# Altium schematic sheet FPGA_IOs.SchDoc: FPGA I/Os
size A4; Author: L. Sartory; Organization: L. Sartory; Address2: Nixie clock; Address3: with GPS synchronization; DocumentNumber: 6; Revision: B1; SheetNumber: 6; SheetTotal: 12
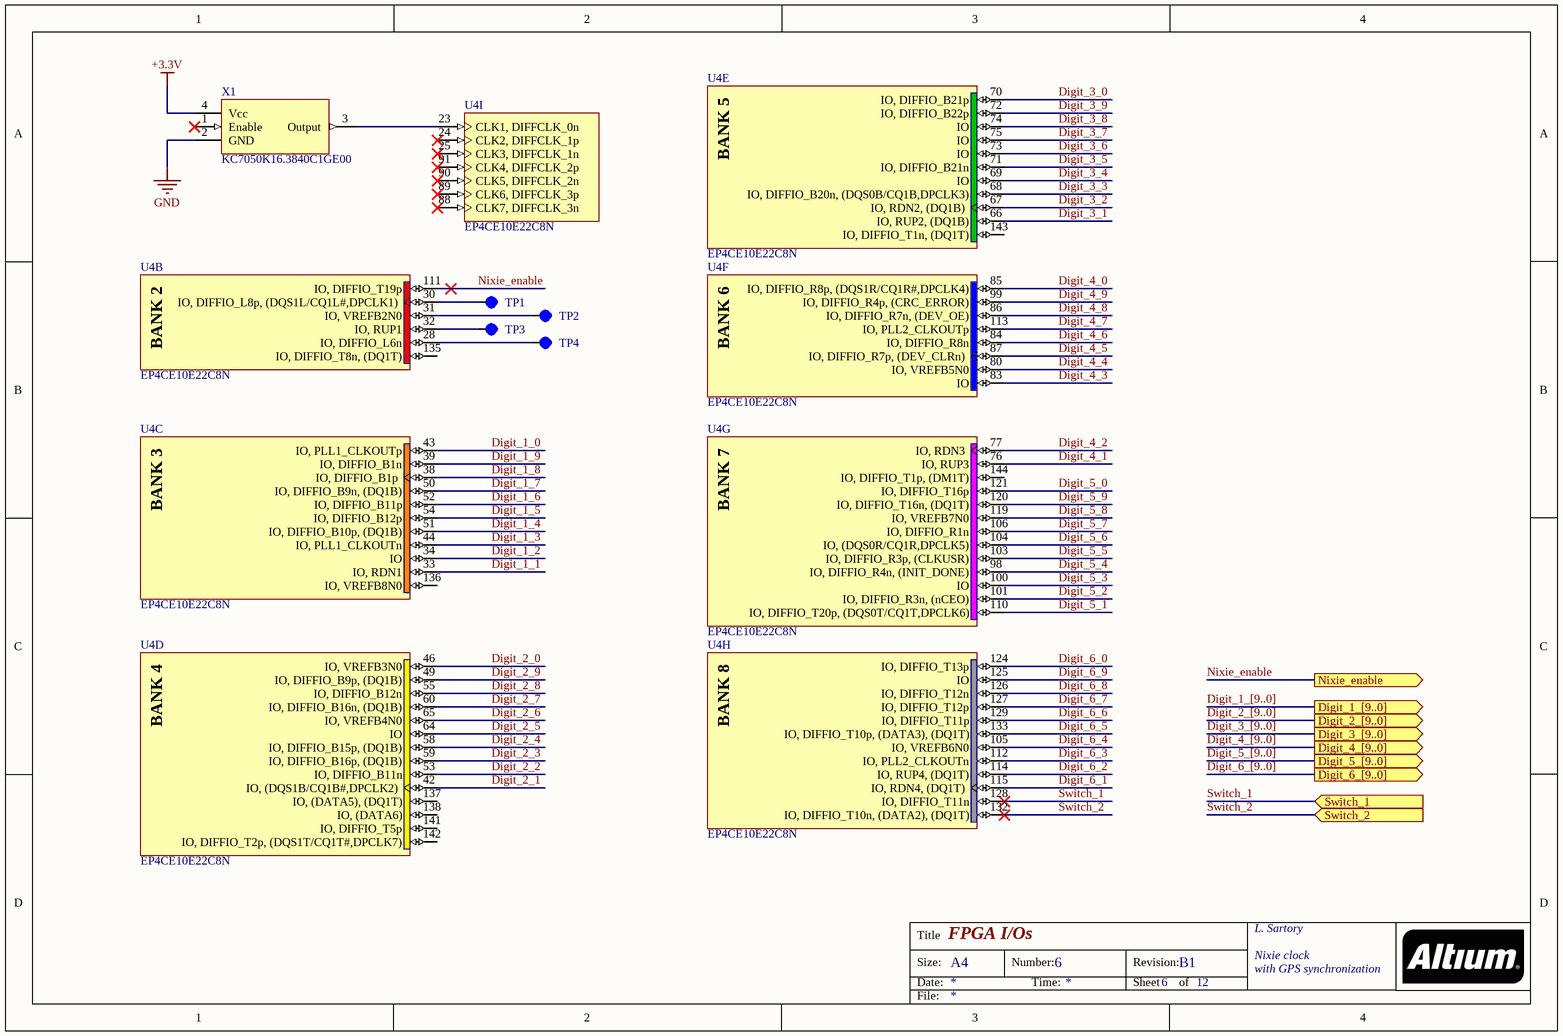
[diagram p0: FPGA_IOs.SchDoc]

## Parts
TP1  Test_point_1mm  [TEST_POINT_1MM]  (value not drawn)  (no BOM)
TP2  Test_point_1mm  [TEST_POINT_1MM]  (value not drawn)  (no BOM)
TP3  Test_point_1mm  [TEST_POINT_1MM]  (value not drawn)  (no BOM)
TP4  Test_point_1mm  [TEST_POINT_1MM]  (value not drawn)  (no BOM)
U4  EP4CE10E22C8N  [EP4CE10E22C8N]  (parts B,C,D,E,F,G,H,I of 13)
X1  KC7050K16.3840C1GE00  [KC7050K16.3840C1GE00]

## Ports
Digit_1_[9..0] (out), Digit_2_[9..0] (out), Digit_3_[9..0] (out), Digit_4_[9..0] (out), Digit_5_[9..0] (out), Digit_6_[9..0] (out), Nixie_enable (out), Switch_1 (in), Switch_2 (in)

## Nets
+3.3V: X1.4(Vcc)
GND: X1.2(GND)
Digit_1_0: U4.43(IO,_PLL1_CLKOUTp)
Digit_1_1: U4.33(IO,_RDN1)
Digit_1_2: U4.34(IO)
Digit_1_3: U4.44(IO,_PLL1_CLKOUTn)
Digit_1_4: U4.51(IO,_DIFFIO_B10p,_(DQ1B))
Digit_1_5: U4.54(IO,_DIFFIO_B12p)
Digit_1_6: U4.52(IO,_DIFFIO_B11p)
Digit_1_7: U4.50(IO,_DIFFIO_B9n,_(DQ1B))
Digit_1_8: U4.38(IO,_DIFFIO_B1p)
Digit_1_9: U4.39(IO,_DIFFIO_B1n)
Digit_2_0: U4.46(IO,_VREFB3N0)
Digit_2_1: U4.42(IO,_(DQS1B/CQ1B#,DPCLK2))
Digit_2_2: U4.53(IO,_DIFFIO_B11n)
Digit_2_3: U4.59(IO,_DIFFIO_B16p,_(DQ1B))
Digit_2_4: U4.58(IO,_DIFFIO_B15p,_(DQ1B))
Digit_2_5: U4.64(IO)
Digit_2_6: U4.65(IO,_VREFB4N0)
Digit_2_7: U4.60(IO,_DIFFIO_B16n,_(DQ1B))
Digit_2_8: U4.55(IO,_DIFFIO_B12n)
Digit_2_9: U4.49(IO,_DIFFIO_B9p,_(DQ1B))
Digit_3_0: U4.70(IO,_DIFFIO_B21p)
Digit_3_1: U4.66(IO,_RUP2,_(DQ1B))
Digit_3_2: U4.67(IO,_RDN2,_(DQ1B))
Digit_3_3: U4.68(IO,_DIFFIO_B20n,_(DQS0B/CQ1B,DPCLK3))
Digit_3_4: U4.69(IO)
Digit_3_5: U4.71(IO,_DIFFIO_B21n)
Digit_3_6: U4.73(IO)
Digit_3_7: U4.75(IO)
Digit_3_8: U4.74(IO)
Digit_3_9: U4.72(IO,_DIFFIO_B22p)
Digit_4_0: U4.85(IO,_DIFFIO_R8p,_(DQS1R/CQ1R#,DPCLK4))
Digit_4_1: U4.76(IO,_RUP3)
Digit_4_2: U4.77(IO,_RDN3)
Digit_4_3: U4.83(IO)
Digit_4_4: U4.80(IO,_VREFB5N0)
Digit_4_5: U4.87(IO,_DIFFIO_R7p,_(DEV_CLRn))
Digit_4_6: U4.84(IO,_DIFFIO_R8n)
Digit_4_7: U4.113(IO,_PLL2_CLKOUTp)
Digit_4_8: U4.86(IO,_DIFFIO_R7n,_(DEV_OE))
Digit_4_9: U4.99(IO,_DIFFIO_R4p,_(CRC_ERROR))
Digit_5_0: U4.121(IO,_DIFFIO_T16p)
Digit_5_1: U4.110(IO,_DIFFIO_T20p,_(DQS0T/CQ1T,DPCLK6))
Digit_5_2: U4.101(IO,_DIFFIO_R3n,_(nCEO))
Digit_5_3: U4.100(IO)
Digit_5_4: U4.98(IO,_DIFFIO_R4n,_(INIT_DONE))
Digit_5_5: U4.103(IO,_DIFFIO_R3p,_(CLKUSR))
Digit_5_6: U4.104(IO,_(DQS0R/CQ1R,DPCLK5))
Digit_5_7: U4.106(IO,_DIFFIO_R1n)
Digit_5_8: U4.119(IO,_VREFB7N0)
Digit_5_9: U4.120(IO,_DIFFIO_T16n,_(DQ1T))
Digit_6_0: U4.124(IO,_DIFFIO_T13p)
Digit_6_1: U4.115(IO,_RDN4,_(DQ1T))
Digit_6_2: U4.114(IO,_RUP4,_(DQ1T))
Digit_6_3: U4.112(IO,_PLL2_CLKOUTn)
Digit_6_4: U4.105(IO,_VREFB6N0)
Digit_6_5: U4.133(IO,_DIFFIO_T10p,_(DATA3),_(DQ1T))
Digit_6_6: U4.129(IO,_DIFFIO_T11p)
Digit_6_7: U4.127(IO,_DIFFIO_T12p)
Digit_6_8: U4.126(IO,_DIFFIO_T12n)
Digit_6_9: U4.125(IO)
Nixie_enable: U4.111(IO,_DIFFIO_T19p) ; port Nixie_enable
Switch_1: U4.128(IO,_DIFFIO_T11n) ; port Switch_1
Switch_2: U4.132(IO,_DIFFIO_T10n,_(DATA2),_(DQ1T)) ; port Switch_2
NetTP1_TP: TP1.TP U4.30(IO,_DIFFIO_L8p,_(DQS1L/CQ1L#,DPCLK1))
NetTP2_TP: TP2.TP U4.31(IO,_VREFB2N0)
NetTP3_TP: TP3.TP U4.32(IO,_RUP1)
NetTP4_TP: TP4.TP U4.28(IO,_DIFFIO_L6n)
NetU4_23: U4.23(CLK1,_DIFFCLK_0n) X1.3(Output)

Not connected (* = marked no-connect by the designer): U4 24(CLK2,_DIFFCLK_1p)* 25(CLK3,_DIFFCLK_1n)* 88(CLK7,_DIFFCLK_3n)* 89(CLK6,_DIFFCLK_3p)* 90(CLK5,_DIFFCLK_2n)* 91(CLK4,_DIFFCLK_2p)* 135(IO,_DIFFIO_T8n,_(DQ1T)) 136(IO,_VREFB8N0) 137(IO,_(DATA5),_(DQ1T)) 138(IO,_(DATA6)) 141(IO,_DIFFIO_T5p) 142(IO,_DIFFIO_T2p,_(DQS1T/CQ1T#,DPCLK7)) 143(IO,_DIFFIO_T1n,_(DQ1T)) 144(IO,_DIFFIO_T1p,_(DM1T)); X1 1(Enable)*

## Buses and harness runs
bus Digit_1_[9..0] = port Digit_1_[9..0]
bus Digit_2_[9..0] = port Digit_2_[9..0]
bus Digit_3_[9..0] = port Digit_3_[9..0]
bus Digit_4_[9..0] = port Digit_4_[9..0]
bus Digit_5_[9..0] = port Digit_5_[9..0]
bus Digit_6_[9..0] = port Digit_6_[9..0]

## Notes on the sheet
- Title
- Size:
- Date:
- A4
- Number:
- Time:
- Revision:
- Sheet
- of
- File:
- (in symbol EP4CE10E22C8N, part B) BANK 2
- (in symbol EP4CE10E22C8N, part C) BANK 3
- (in symbol EP4CE10E22C8N, part D) BANK 4
- (in symbol EP4CE10E22C8N, part E) BANK 5
- (in symbol EP4CE10E22C8N, part F) BANK 6
- (in symbol EP4CE10E22C8N, part G) BANK 7
- (in symbol EP4CE10E22C8N, part H) BANK 8

## Library data of the parts
TP1-TP4 = Test_point_1mm: 1mm test point
U4 = EP4CE10E22C8N: Cyclone IV Family FPGA, 1.2V Core, 91 I/O Pins, 2 PLLs, 144-Pin QFP, Speed Grade 8, Commercial Grade, Pb-Free; Manufacturer: Altera; PackageDescription: 144-Pin Plastic Enhanced Quad Flat Pack (EQFP) - Wire Bond - A:1.65 - D2:5.4; ComponentLink2Description: Handbook; DatasheetVersion: ver1.6, Nov-2011; ComponentLink2URL: http://www.altera.com/literature/hb/cyclone-iv/cyclone4-handbook.pdf; PackageVersion: ver1.0, Jan-2011; ComponentLink1URL: http://www.altera.com/; ComponentLink3Description: Pinout; ComponentLink4Description: Package Specification; PackageReference: EQFP144_A-165_D2-54; Code_JEDEC: MS-026-BFB-HD; ComponentLink3URL: http://www.altera.com/literature/lit-dp.jsp?category=cyc%204&showspreadsheet=y; ComponentLink1Description: Manufacturer URL; ComponentLink4URL: http://www.altera.com/devicepackaging/04R00402-00.pdf
X1 = KC7050K16.3840C1GE00: Clock Oscillator, 16.384 MHz, 7x5mm